# Altium project 四旋翼飞控.PrjPCB
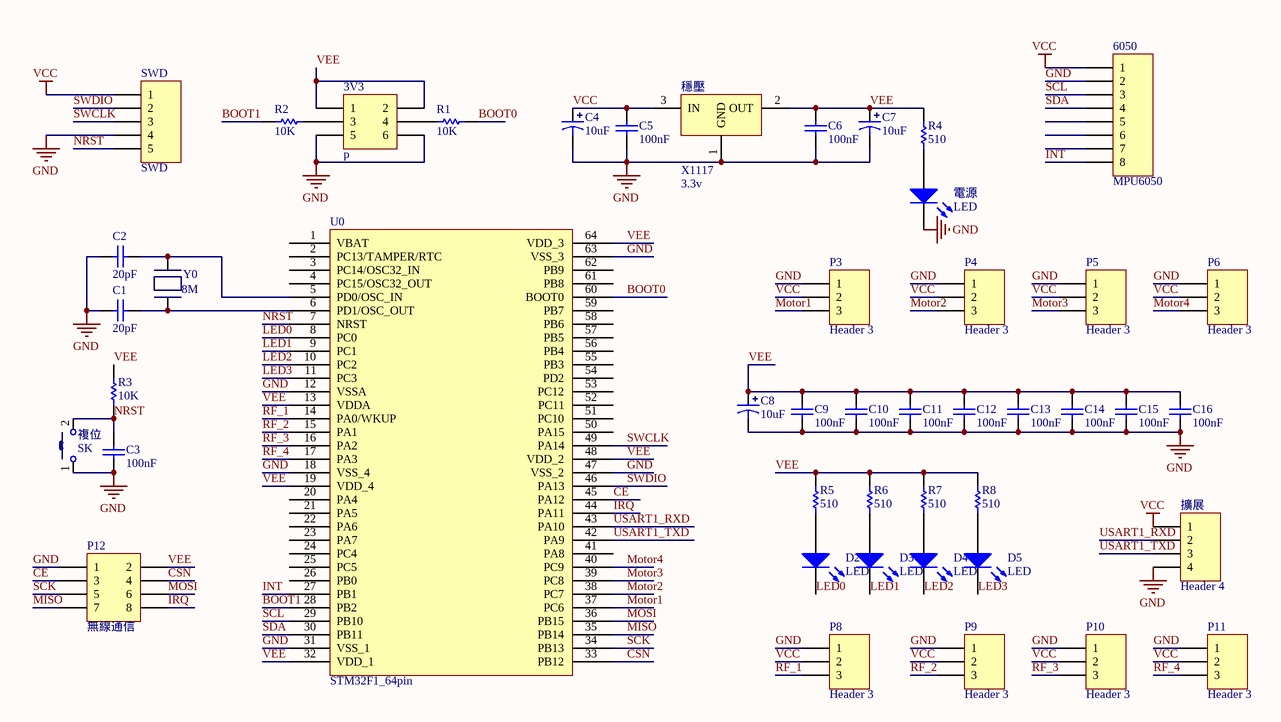
[diagram p0: 四旋翼飞控.SchDoc]
1 sheet, 46 parts. Net scope: global (net labels, ports and power ports of the same name join across sheets).
Board file: 四旋翼飞控.PcbDoc

## Sheet 四旋翼飞控.SchDoc
size A4

### Parts
3V3  p  [HDR2X3]
6050  MPU6050  [HDR1X8]
C1  20pF  [C0603]
C2  20pF  [C0603]
C3  100nF  [C0603]
C4  10uF  [C_B3528]
C5  100nF  [C0603]
C6  100nF  [C0603]
C7  10uF  [C_B3528]
C8  10uF  [C_B3528]
C9  100nF  [C0603]
C10  100nF  [C0603]
C11  100nF  [C0603]
C12  100nF  [C0603]
C13  100nF  [C0603]
C14  100nF  [C0603]
C15  100nF  [C0603]
C16  100nF  [C0603]
D2  LED  [LED]
D3  LED  [LED]
D4  LED  [LED]
D5  LED  [LED]
P3  Header 3  [HDR1X3]
P4  Header 3  [HDR1X3]
P5  Header 3  [HDR1X3]
P6  Header 3  [HDR1X3]
P8  Header 3  [HDR1X3]
P9  Header 3  [HDR1X3]
P10  Header 3  [HDR1X3]
P11  Header 3  [HDR1X3]
P12  無線通信  [HDR2X4]
R1  10K  [R0805]
R2  10K  [R0805]
R3  10K  [R0805]
R4  510  [R0805]
R5  510  [R0805]
R6  510  [R0805]
R7  510  [R0805]
R8  510  [R0805]
SWD  SWD  [HDR1X5]
U0  STM32F1_64pin  [LQFP64]
Y0  8M  [Y]
擴展  Header 4  [HDR1X4]
穩壓  X1117  value 3.3v  [X1117]
複位  SK  [KEY]
電源  LED  [LED]

### Nets
GND: 3V3.5 3V3.6 6050.2 C1.1 C2.1 C3.1 C4.2 C5.1 C6.1 C7.2 C8.2 C9.1 C10.1 C11.1 C12.1 C13.1 C14.1 C15.1 C16.1 P3.1 P4.1 P5.1 P6.1 P8.1 P9.1 P10.1 P11.1 P12.1 SWD.4 U0.12(VSSA) U0.18(VSS_4) U0.31(VSS_1) U0.47(VSS_2) U0.63(VSS_3) 擴展.4 穩壓.1(GND) 複位.1 電源.2(K)
VCC: 6050.1 C4.1 C5.2 P3.2 P4.2 P5.2 P6.2 P8.2 P9.2 P10.2 P11.2 SWD.1 擴展.1 穩壓.3(IN)
BOOT0: R1.2(BOT) U0.60(BOOT0)
BOOT1: R2.1(TOP) U0.28(PB2)
CE: P12.3 U0.45(PA12)
CSN: P12.4 U0.33(PB12)
INT: 6050.8 U0.27(PB1)
IRQ: P12.8 U0.44(PA11)
LED0: D2.2(K) U0.8(PC0)
LED1: D3.2(K) U0.9(PC1)
LED2: D4.2(K) U0.10(PC2)
LED3: D5.2(K) U0.11(PC3)
MISO: P12.7 U0.35(PB14)
MOSI: P12.6 U0.36(PB15)
Motor1: P3.3 U0.37(PC6)
Motor2: P4.3 U0.38(PC7)
Motor3: P5.3 U0.39(PC8)
Motor4: P6.3 U0.40(PC9)
NRST: C3.2 R3.2(BOT) SWD.5 U0.7(NRST) 複位.2
RF_1: P8.3 U0.14(PA0/WKUP)
RF_2: P9.3 U0.15(PA1)
RF_3: P10.3 U0.16(PA2)
RF_4: P11.3 U0.17(PA3)
SCK: P12.5 U0.34(PB13)
SCL: 6050.3 U0.29(PB10)
SDA: 6050.4 U0.30(PB11)
SWCLK: SWD.3 U0.49(PA14)
SWDIO: SWD.2 U0.46(PA13)
USART1_RXD: U0.43(PA10) 擴展.2
USART1_TXD: U0.42(PA9) 擴展.3
VEE: 3V3.1 3V3.2 C6.2 C7.1 C8.1 C9.2 C10.2 C11.2 C12.2 C13.2 C14.2 C15.2 C16.2 P12.2 R3.1(TOP) R4.1(TOP) R5.1(TOP) R6.1(TOP) R7.1(TOP) R8.1(TOP) U0.13(VDDA) U0.19(VDD_4) U0.32(VDD_1) U0.48(VDD_2) U0.64(VDD_3) 穩壓.2(OUT)
Net3V3_3: 3V3.3 R2.2(BOT)
Net3V3_4: 3V3.4 R1.1(TOP)
NetC1_2: C1.2 U0.6(PD1/OSC_OUT) Y0.1
NetC2_2: C2.2 U0.5(PD0/OSC_IN) Y0.0
NetD2_1: D2.1(A) R5.2(BOT)
NetD3_1: D3.1(A) R6.2(BOT)
NetD4_1: D4.1(A) R7.2(BOT)
NetD5_1: D5.1(A) R8.2(BOT)
NetR4_2: R4.2(BOT) 電源.1(A)

Not connected (* = marked no-connect by the designer): 6050 5 6 7; U0 1(VBAT) 2(PC13/TAMPER/RTC) 3(PC14/OSC32_IN) 4(PC15/OSC32_OUT) 20(PA4) 21(PA5) 22(PA6) 23(PA7) 24(PC4) 25(PC5) 26(PB0) 41(PA8) 50(PA15) 51(PC10) 52(PC11) 53(PC12) 54(PD2) 55(PB3) 56(PB4) 57(PB5) 58(PB6) 59(PB7) 61(PB8) 62(PB9)

### Library data of the parts
3V3 = Header 3X2: Header, 3-Pin, Dual row; LatestRevisionDate: 17-Jul-2002; LatestRevisionNote: Re-released for DXP Platform.; Publisher: Altium Limited
6050 = Header 8: Header, 8-Pin; LatestRevisionDate: 17-Jul-2002; LatestRevisionNote: Re-released for DXP Platform.; Publisher: Altium Limited
C1 C2 = Cap: Capacitor; Value: 100nF; Published: 8-Jun-2000; LatestRevisionDate: 17-Jul-2002; LatestRevisionNote: Re-released for DXP Platform.; PackageReference: RAD-0.3; Publisher: Altium Limited; PackageDescription: Radial Cap, Thru-Hole; 2 Leads; 0.3 in Pin Spacing
C3 C5 C6 C9-C16 = Cap: Capacitor; Published: 8-Jun-2000; LatestRevisionDate: 17-Jul-2002; LatestRevisionNote: Re-released for DXP Platform.; PackageReference: RAD-0.3; Publisher: Altium Limited; PackageDescription: Radial Cap, Thru-Hole; 2 Leads; 0.3 in Pin Spacing; Value: 100nF
C4 C7 C8 = Cap2: Capacitor; Published: 23-Sep-2002; PackageReference: CAPR5-4X5; Publisher: Altium Limited; PackageDescription: Capacitor; 2 Leads; Value: 10uF
D2-D5 電源 = LED: Typical BLUE SiC LED; Published: 8-Jun-2000; LatestRevisionDate: 17-Dec-2003; LatestRevisionNote: PCB Footprint replaced.; DatasheetVersion: 16-Apr-2002; PackageVersion: 16-Apr-2002; PackageReference: 3.5X2.8X1.9; Publisher: Altium Limited; PackageDescription: SM LED; 2 C-Bend Leads; Body 3.5 x 2.8 x 1.9 mm, inc leads (LxWxH typ)
P3-P6 P8-P11 = Header 3: Header, 3-Pin; LatestRevisionDate: 17-Jul-2002; LatestRevisionNote: Re-released for DXP Platform.; Publisher: Altium Limited
P12 = Header 4X2: Header, 4-Pin, Dual row; LatestRevisionDate: 17-Jul-2002; LatestRevisionNote: Re-released for DXP Platform.; Publisher: Altium Limited
R1-R8 = Res: Potentiometer; Sim Note: Enter the Resistance value and the set point into parameter fields.; Set Position: 0.5; Value: 1K; Published: 8-Jun-2000; LatestRevisionDate: 17-Jul-2002; LatestRevisionNote: Re-released for DXP Platform.; PackageReference: VR5; Publisher: Altium Limited; PackageDescription: Variable Resistor, Thru-Hole; 3 Leads
SWD = Header 5: Header, 5-Pin; LatestRevisionDate: 17-Jul-2002; LatestRevisionNote: Re-released for DXP Platform.; Publisher: Altium Limited
Y0 = 无源晶振: value: 11.0592M
擴展 = Header 4: Header, 4-Pin; LatestRevisionDate: 17-Jul-2002; LatestRevisionNote: Re-released for DXP Platform.; Publisher: Altium Limited
複位 = KEY